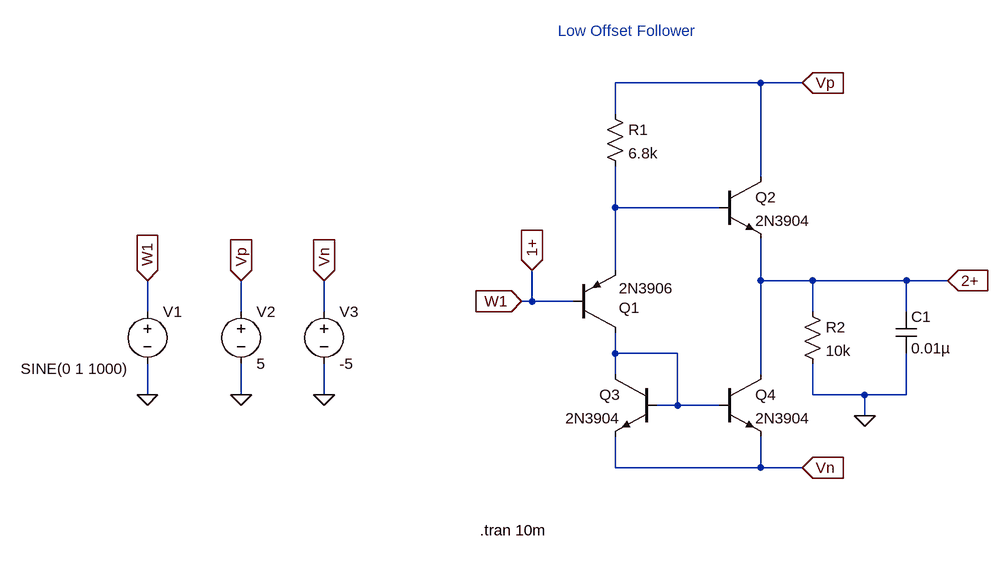
[diagram p0: schematic low_off_flw_ltspice.asc]
low_off_flw_ltspice.asc, the LTspice schematic file:
Version 4
SHEET 1 916 680
WIRE 352 -368 128 -368
WIRE 416 -368 352 -368
WIRE 128 -320 128 -368
WIRE 352 -224 352 -368
WIRE 128 -176 128 -240
WIRE 288 -176 128 -176
WIRE 128 -80 128 -176
WIRE 352 -64 352 -128
WIRE 432 -64 352 -64
WIRE 576 -64 432 -64
WIRE 640 -64 576 -64
WIRE 0 -32 0 -80
WIRE 0 -32 -16 -32
WIRE 64 -32 0 -32
WIRE -592 -16 -592 -64
WIRE -448 -16 -448 -64
WIRE -320 -16 -320 -64
WIRE 432 -16 432 -64
WIRE 576 -16 576 -64
WIRE 128 48 128 16
WIRE 224 48 128 48
WIRE 128 80 128 48
WIRE 352 80 352 -64
WIRE -592 112 -592 64
WIRE -448 112 -448 64
WIRE -320 112 -320 64
WIRE 432 112 432 64
WIRE 512 112 432 112
WIRE 576 112 576 48
WIRE 576 112 512 112
WIRE 224 128 224 48
WIRE 224 128 192 128
WIRE 288 128 224 128
WIRE 512 144 512 112
WIRE 128 224 128 176
WIRE 352 224 352 176
WIRE 352 224 128 224
WIRE 416 224 352 224
FLAG -592 112 0
FLAG -448 112 0
FLAG -320 112 0
FLAG -592 -64 W1
IOPIN -592 -64 In
FLAG -448 -64 Vp
IOPIN -448 -64 In
FLAG -320 -64 Vn
IOPIN -320 -64 In
FLAG 512 144 0
FLAG -16 -32 W1
IOPIN -16 -32 In
FLAG 416 -368 Vp
IOPIN 416 -368 In
FLAG 416 224 Vn
IOPIN 416 224 In
FLAG 0 -80 1+
IOPIN 0 -80 In
FLAG 640 -64 2+
IOPIN 640 -64 In
SYMBOL voltage -592 -32 R0
WINDOW 3 -195 104 Left 2
WINDOW 123 0 0 Left 0
WINDOW 39 0 0 Left 0
SYMATTR Value SINE(0 1 1000)
SYMATTR InstName V1
SYMBOL voltage -448 -32 R0
WINDOW 123 0 0 Left 0
WINDOW 39 0 0 Left 0
SYMATTR InstName V2
SYMATTR Value 5
SYMBOL voltage -320 -32 R0
WINDOW 123 0 0 Left 0
WINDOW 39 0 0 Left 0
SYMATTR InstName V3
SYMATTR Value -5
SYMBOL pnp 64 16 M180
WINDOW 0 70 38 Left 2
WINDOW 3 70 68 Left 2
SYMATTR InstName Q1
SYMATTR Value 2N3906
SYMBOL npn 288 -224 R0
SYMATTR InstName Q2
SYMATTR Value 2N3904
SYMBOL npn 192 80 M0
SYMATTR InstName Q3
SYMATTR Value 2N3904
SYMBOL npn 288 80 R0
SYMATTR InstName Q4
SYMATTR Value 2N3904
SYMBOL res 112 -336 R0
SYMATTR InstName R1
SYMATTR Value 6.8k
SYMBOL res 416 -32 R0
SYMATTR InstName R2
SYMATTR Value 10k
SYMBOL cap 560 -16 R0
SYMATTR InstName C1
SYMATTR Value 0.01µ
TEXT -80 320 Left 2 !.tran 10m
TEXT 40 -448 Left 2 ;Low Offset Follower

The netlist it stands for:
* low_off_flw_ltspice.asc
V1 1+ 0 SINE(0 1 1000)
V2 Vp 0 5
V3 Vn 0 -5
Q1 N002 1+ N001 0 2N3906
Q2 Vp N001 2+ 0 2N3904
Q3 N002 N002 Vn 0 2N3904
Q4 2+ N002 Vn 0 2N3904
R1 Vp N001 6.8k
R2 2+ 0 10k
C1 2+ 0 0.01µ
.model NPN NPN
.model PNP PNP
.lib standard.bjt
.tran 10m
* Low Offset Follower
.backanno
.end